# Altium schematic sheet Input_Connector.SchDoc
size A4
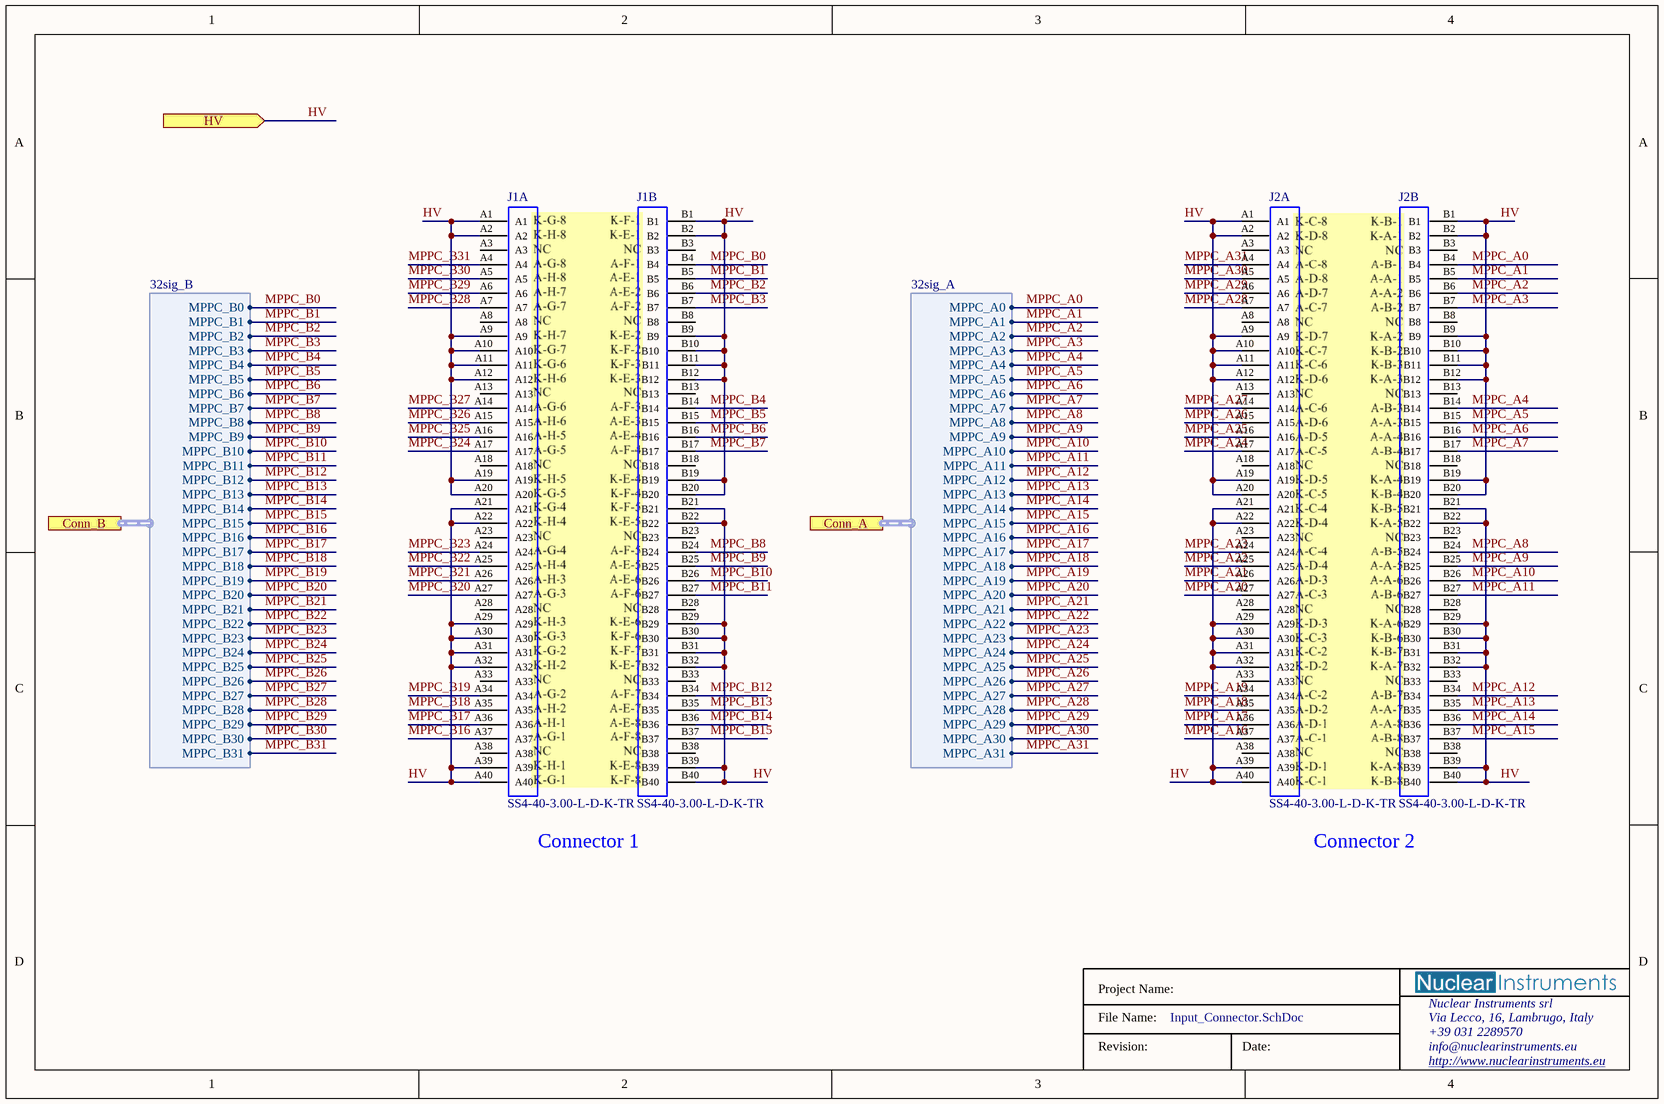
[diagram p0: Input_Connector.SchDoc]

## Parts
J1  SS4-40-3.00-L-D-K-TR  [Samtec_SS4-40-3.00-L-D-K-TR]  (parts A,B of 2)
J2  SS4-40-3.00-L-D-K-TR  [Samtec_SS4-40-3.00-L-D-K-TR]  (parts A,B of 2)

## Ports
Conn_A (harness 32sig_A), Conn_B (harness 32sig_B), HV (in)

## Harnesses
32sig_B: MPPC_B0, MPPC_B1, MPPC_B2, MPPC_B3, MPPC_B4, MPPC_B5, MPPC_B6, MPPC_B7, MPPC_B8, MPPC_B9, MPPC_B10, MPPC_B11, MPPC_B12, MPPC_B13, MPPC_B14, MPPC_B15, MPPC_B16, MPPC_B17, MPPC_B18, MPPC_B19, MPPC_B20, MPPC_B21, MPPC_B22, MPPC_B23, MPPC_B24, MPPC_B25, MPPC_B26, MPPC_B27, MPPC_B28, MPPC_B29, MPPC_B30, MPPC_B31
32sig_A: MPPC_A0, MPPC_A1, MPPC_A2, MPPC_A3, MPPC_A4, MPPC_A5, MPPC_A6, MPPC_A7, MPPC_A8, MPPC_A9, MPPC_A10, MPPC_A11, MPPC_A12, MPPC_A13, MPPC_A14, MPPC_A15, MPPC_A16, MPPC_A17, MPPC_A18, MPPC_A19, MPPC_A20, MPPC_A21, MPPC_A22, MPPC_A23, MPPC_A24, MPPC_A25, MPPC_A26, MPPC_A27, MPPC_A28, MPPC_A29, MPPC_A30, MPPC_A31

## Nets
HV: J1.A1 J1.A2 J1.A9 J1.A10 J1.A11 J1.A12 J1.A19 J1.A20 J1.A21 J1.A22 J1.A29 J1.A30 J1.A31 J1.A32 J1.A39 J1.A40 J1.B1 J1.B2 J1.B9 J1.B10 J1.B11 J1.B12 J1.B19 J1.B20 J1.B21 J1.B22 J1.B29 J1.B30 J1.B31 J1.B32 J1.B39 J1.B40 J2.A1 J2.A2 J2.A9 J2.A10 J2.A11 J2.A12 J2.A19 J2.A20 J2.A21 J2.A22 J2.A29 J2.A30 J2.A31 J2.A32 J2.A39 J2.A40 J2.B1 J2.B2 J2.B9 J2.B10 J2.B11 J2.B12 J2.B19 J2.B20 J2.B21 J2.B22 J2.B29 J2.B30 J2.B31 J2.B32 J2.B39 J2.B40 ; port HV
MPPC_A0: J2.B4 ; port Conn_A.MPPC_A0
MPPC_A1: J2.B5 ; port Conn_A.MPPC_A1
MPPC_A2: J2.B6 ; port Conn_A.MPPC_A2
MPPC_A3: J2.B7 ; port Conn_A.MPPC_A3
MPPC_A4: J2.B14 ; port Conn_A.MPPC_A4
MPPC_A5: J2.B15 ; port Conn_A.MPPC_A5
MPPC_A6: J2.B16 ; port Conn_A.MPPC_A6
MPPC_A7: J2.B17 ; port Conn_A.MPPC_A7
MPPC_A8: J2.B24 ; port Conn_A.MPPC_A8
MPPC_A9: J2.B25 ; port Conn_A.MPPC_A9
MPPC_A10: J2.B26 ; port Conn_A.MPPC_A10
MPPC_A11: J2.B27 ; port Conn_A.MPPC_A11
MPPC_A12: J2.B34 ; port Conn_A.MPPC_A12
MPPC_A13: J2.B35 ; port Conn_A.MPPC_A13
MPPC_A14: J2.B36 ; port Conn_A.MPPC_A14
MPPC_A15: J2.B37 ; port Conn_A.MPPC_A15
MPPC_A16: J2.A37 ; port Conn_A.MPPC_A16
MPPC_A17: J2.A36 ; port Conn_A.MPPC_A17
MPPC_A18: J2.A35 ; port Conn_A.MPPC_A18
MPPC_A19: J2.A34 ; port Conn_A.MPPC_A19
MPPC_A20: J2.A27 ; port Conn_A.MPPC_A20
MPPC_A21: J2.A26 ; port Conn_A.MPPC_A21
MPPC_A22: J2.A25 ; port Conn_A.MPPC_A22
MPPC_A23: J2.A24 ; port Conn_A.MPPC_A23
MPPC_A24: J2.A17 ; port Conn_A.MPPC_A24
MPPC_A25: J2.A16 ; port Conn_A.MPPC_A25
MPPC_A26: J2.A15 ; port Conn_A.MPPC_A26
MPPC_A27: J2.A14 ; port Conn_A.MPPC_A27
MPPC_A28: J2.A7 ; port Conn_A.MPPC_A28
MPPC_A29: J2.A6 ; port Conn_A.MPPC_A29
MPPC_A30: J2.A5 ; port Conn_A.MPPC_A30
MPPC_A31: J2.A4 ; port Conn_A.MPPC_A31
MPPC_B0: J1.B4 ; port Conn_B.MPPC_B0
MPPC_B1: J1.B5 ; port Conn_B.MPPC_B1
MPPC_B2: J1.B6 ; port Conn_B.MPPC_B2
MPPC_B3: J1.B7 ; port Conn_B.MPPC_B3
MPPC_B4: J1.B14 ; port Conn_B.MPPC_B4
MPPC_B5: J1.B15 ; port Conn_B.MPPC_B5
MPPC_B6: J1.B16 ; port Conn_B.MPPC_B6
MPPC_B7: J1.B17 ; port Conn_B.MPPC_B7
MPPC_B8: J1.B24 ; port Conn_B.MPPC_B8
MPPC_B9: J1.B25 ; port Conn_B.MPPC_B9
MPPC_B10: J1.B26 ; port Conn_B.MPPC_B10
MPPC_B11: J1.B27 ; port Conn_B.MPPC_B11
MPPC_B12: J1.B34 ; port Conn_B.MPPC_B12
MPPC_B13: J1.B35 ; port Conn_B.MPPC_B13
MPPC_B14: J1.B36 ; port Conn_B.MPPC_B14
MPPC_B15: J1.B37 ; port Conn_B.MPPC_B15
MPPC_B16: J1.A37 ; port Conn_B.MPPC_B16
MPPC_B17: J1.A36 ; port Conn_B.MPPC_B17
MPPC_B18: J1.A35 ; port Conn_B.MPPC_B18
MPPC_B19: J1.A34 ; port Conn_B.MPPC_B19
MPPC_B20: J1.A27 ; port Conn_B.MPPC_B20
MPPC_B21: J1.A26 ; port Conn_B.MPPC_B21
MPPC_B22: J1.A25 ; port Conn_B.MPPC_B22
MPPC_B23: J1.A24 ; port Conn_B.MPPC_B23
MPPC_B24: J1.A17 ; port Conn_B.MPPC_B24
MPPC_B25: J1.A16 ; port Conn_B.MPPC_B25
MPPC_B26: J1.A15 ; port Conn_B.MPPC_B26
MPPC_B27: J1.A14 ; port Conn_B.MPPC_B27
MPPC_B28: J1.A7 ; port Conn_B.MPPC_B28
MPPC_B29: J1.A6 ; port Conn_B.MPPC_B29
MPPC_B30: J1.A5 ; port Conn_B.MPPC_B30
MPPC_B31: J1.A4 ; port Conn_B.MPPC_B31

Not connected (* = marked no-connect by the designer): J1 A3 A8 A13 A18 A23 A28 A33 A38 B3 B8 B13 B18 B23 B28 B33 B38; J2 A3 A8 A13 A18 A23 A28 A33 A38 B3 B8 B13 B18 B23 B28 B33 B38

## Notes on the sheet
- (near J1) Connector 1
- (near J2) Connector 2
- Project Name:
- Revision:
- File Name:
- Date:
- Nuclear Instruments srl
- Via Lecco, 16, Lambrugo, Italy
- +39 031 2289570
- info@nuclearinstruments.eu
- http://www.nuclearinstruments.eu

## Library data of the parts
J1 J2 = Samtec_SS4-40-3.00-L-D-K-TR: ULTRA FINE PITCH SOCKET